# EAGLE design lab3 (EAGLE 7.6.0)
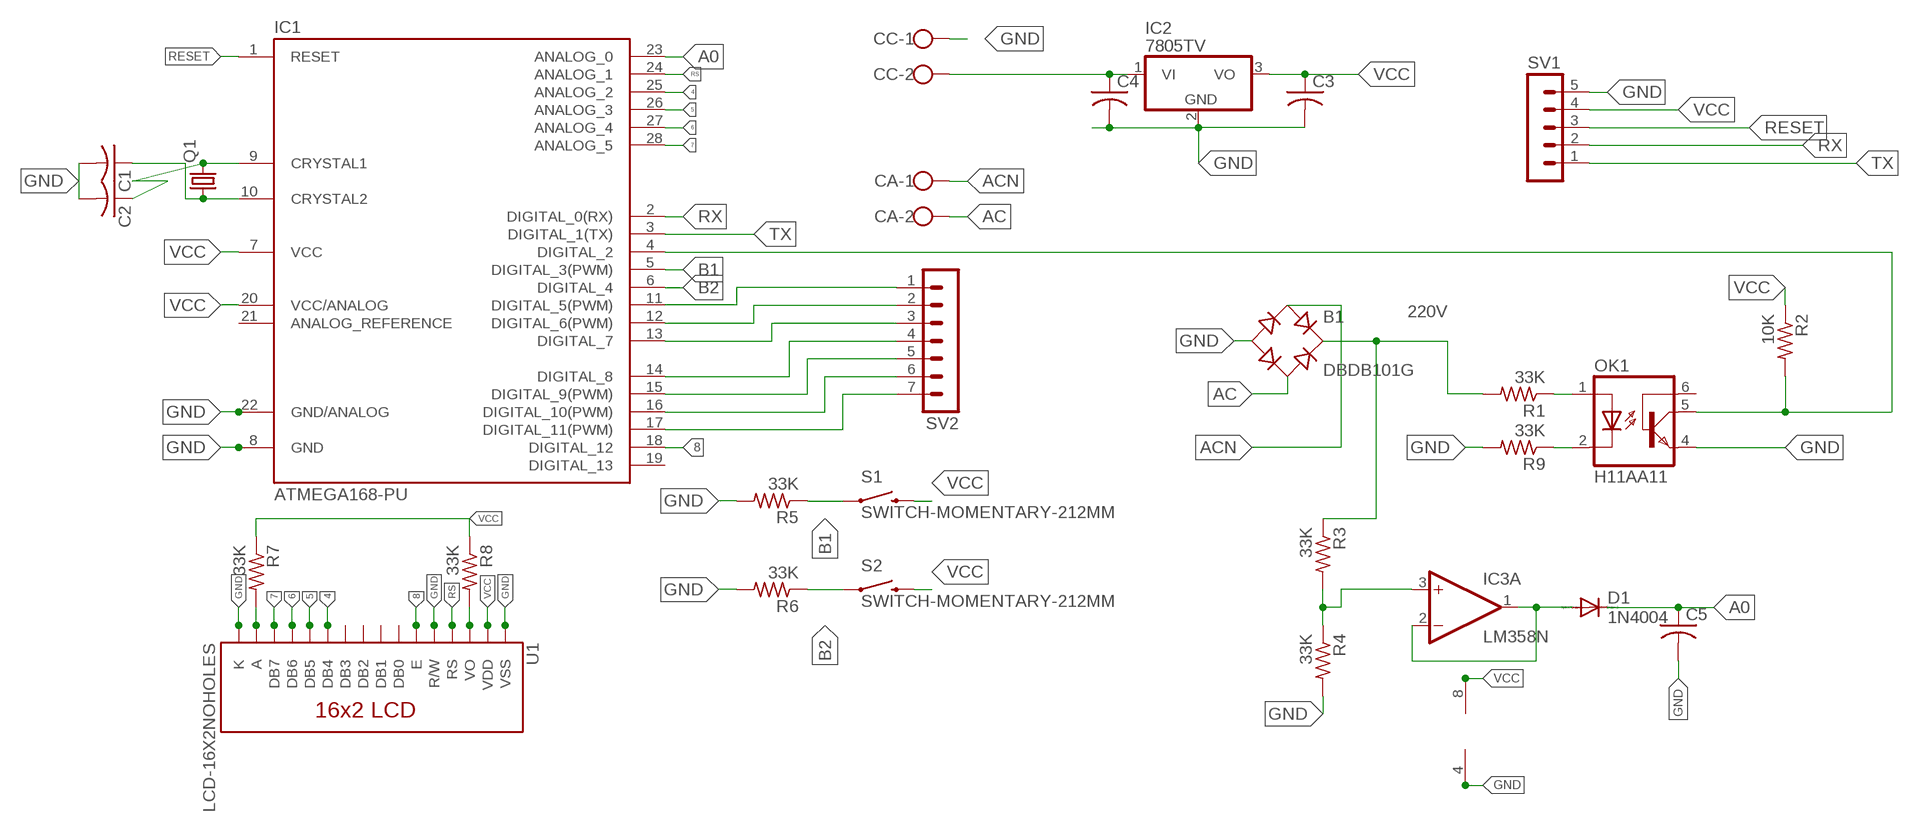
[diagram p0: schematic, sheet 1]

## Parts
B1  DBDB101G  [DB]
C1  C-US025-025X050  [C025-025X050]
C2  C-US025-025X050  [C025-025X050]
C3  C-US050-025X075  [C050-025X075]
C4  C-US050-025X075  [C050-025X075]
C5  C-US050-025X075  [C050-025X075]
CA  W237-102  [W237-102]
CC  W237-102  [W237-102]
D1  1N4004  [DO41-10]
IC1  ATMEGA168-PU  [DIL28-3]
IC2  7805TV  [TO220V]
IC3  LM358N  [DIL08]
OK1  H11AA11  [DIL06]
Q1  CRYSTALHC18U-V  [HC18U-V]
R1  33K  R-US_0207/7  [0207/7]
R2  10K  R-US_0207/7  [0207/7]
R3  33K  R-US_0207/7  [0207/7]
R4  33K  R-US_0207/7  [0207/7]
R5  33K  R-US_0207/7  [0207/7]
R6  33K  R-US_0207/7  [0207/7]
R7  33K  R-US_0207/7  [0207/7]
R8  33K  R-US_0207/7  [0207/7]
R9  33K  R-US_0207/7  [0207/7]
S1  SWITCH-MOMENTARY-212MM  [TACTILE-PTH-12MM]
S2  SWITCH-MOMENTARY-212MM  [TACTILE-PTH-12MM]
SV1  MA05-1  [MA05-1]
SV2  MA07-1  [MA07-1]
U1  LCD-16X2NOHOLES  [LCD-16X2_NOHOLES]

## Nets
4: IC1.25(ANALOG_2) U1.11(DB4)
5: IC1.26(ANALOG_3) U1.12(DB5)
6: IC1.27(ANALOG_4) U1.13(DB6)
7: IC1.28(ANALOG_5) U1.14(DB7)
8: IC1.18(DIGITAL_12) U1.6(E)
220V: B1.+ R1.2 R3.1
A0: C5.1 D1.C IC1.23(ANALOG_0)
AC: B1.AC2 CA.2
ACN: B1.AC1 CA.1
B1: IC1.5(DIGITAL_3(PWM)) R5.1 S1.1
B2: IC1.6(DIGITAL_4) R6.1 S2.1
DIG02: IC1.4(DIGITAL_2) OK1.5(COL) R2.2
GND: B1.- C1.2 C2.2 C3.2 C4.2 C5.2 CC.1 IC1.8(GND) IC1.22(GND/ANALOG) IC2.2(GND) IC3.4(P:V-) OK1.4(EMI) R4.2 R5.2 R6.2 R9.2 SV1.5 U1.1(VSS) U1.5(R/W) U1.16(K)
N$1: R7.2 U1.15(A)
N$2: D1.A IC3.1(A:OUT) IC3.2(A:-IN)
N$3: IC3.3(A:+IN) R3.2 R4.1
N$4: OK1.2(C) R9.1
N$5: IC1.11(DIGITAL_5(PWM)) SV2.1
N$6: OK1.1(A) R1.1
N$8: C2.1 IC1.9(CRYSTAL1) Q1.2
N$9: C1.1 IC1.10(CRYSTAL2) Q1.1
N$10: IC1.12(DIGITAL_6(PWM)) SV2.2
N$11: IC1.13(DIGITAL_7) SV2.3
N$12: C4.1 CC.2 IC2.1(VI)
N$13: IC1.14(DIGITAL_8) SV2.4
N$14: IC1.15(DIGITAL_9(PWM)) SV2.5
N$15: IC1.16(DIGITAL_10(PWM)) SV2.6
N$16: R8.2 U1.3(VO)
N$17: IC1.17(DIGITAL_11(PWM)) SV2.7
RESET: IC1.1(RESET) SV1.3
RS: IC1.24(ANALOG_1) U1.4(RS)
RX: IC1.2(DIGITAL_0(RX)) SV1.2
TX: IC1.3(DIGITAL_1(TX)) SV1.1
VCC: C3.1 IC1.7(VCC) IC1.20(VCC/ANALOG) IC2.3(VO) IC3.8(P:V+) R2.1 R7.1 R8.1 S1.3 S2.3 SV1.4 U1.2(VDD)
Unconnected: IC1.19(DIGITAL_13) IC1.21(ANALOG_REFERENCE) IC3.5(B:+IN) IC3.6(B:-IN) IC3.7(B:OUT) OK1.6(BAS) U1.7(DB0) U1.8(DB1) U1.9(DB2) U1.10(DB3)

## Library data of the parts
B1 = rectifier:DB?*G: Single Phase 1.0 AMP Glass Passivated Bridge Rectifier Taiwan Semiconductor Co.,Ltd. - TSC Source: http://www.taiwansemi.com/TSCbig5/ezcatfiles/cust/img/img/db101g.pdf http://www.ts.com.tw/db/pictures/modules/PDT/PDT060207001/DBLS201G.pdf
C1-C5 = adafruit:C-US: CAPACITOR, American symbol
CA CC = con-wago-500:W237-102: WAGO SCREW CLAMP; MPN: 237-102; OC_FARNELL: unknown; OC_NEWARK: 70K9898
D1 = diode:1N4004: DIODE general purpose rectifier, 1 A
IC1 = Arduino-AVR:ATMEGA168-PU
IC2 = linear:78*: Positive VOLTAGE REGULATOR Source: http://cache.national.com/ds/LM/LM78L05.pdf http://www.fairchildsemi.com/ds/LM/LM7805.pdf
IC3 = linear:LM358: OP AMP also LM158; LM258; LM2904 Source: http://cache.national.com/ds/LM/LM158.pdf
OK1 = twomey:H11AA1: Optocoupler AC Input 1 Channel Trans W/Base DC Output 6-Pin DIP Source: http://www.jameco.com/webapp/wcs/stores/servlet/Product_10001_10001_18825_-1; MPN: H11A1-M; OC_FARNELL: 1021358; OC_NEWARK: 97K1793
Q1 = adafruit:CRYSTAL: CRYSTAL; OC_FARNELL: unknown; OC_NEWARK: unknown
R1-R9 = adafruit:R-US_: RESISTOR, American symbol
S1 S2 = SparkFun-Electromechanical:SWITCH-MOMENTARY-2: Various NO switches- pushbuttons, reed, etc; PROD_ID: SWCH-09185
SV1 = con-lstb:MA05-1: PIN HEADER; OC_FARNELL: unknown; OC_NEWARK: unknown
SV2 = con-lstb:MA07-1: PIN HEADER; OC_FARNELL: unknown; OC_NEWARK: unknown
U1 = SparkFun-Displays:LCD-16X2: Standard text-only 16x2 parallel input LCD

## Board
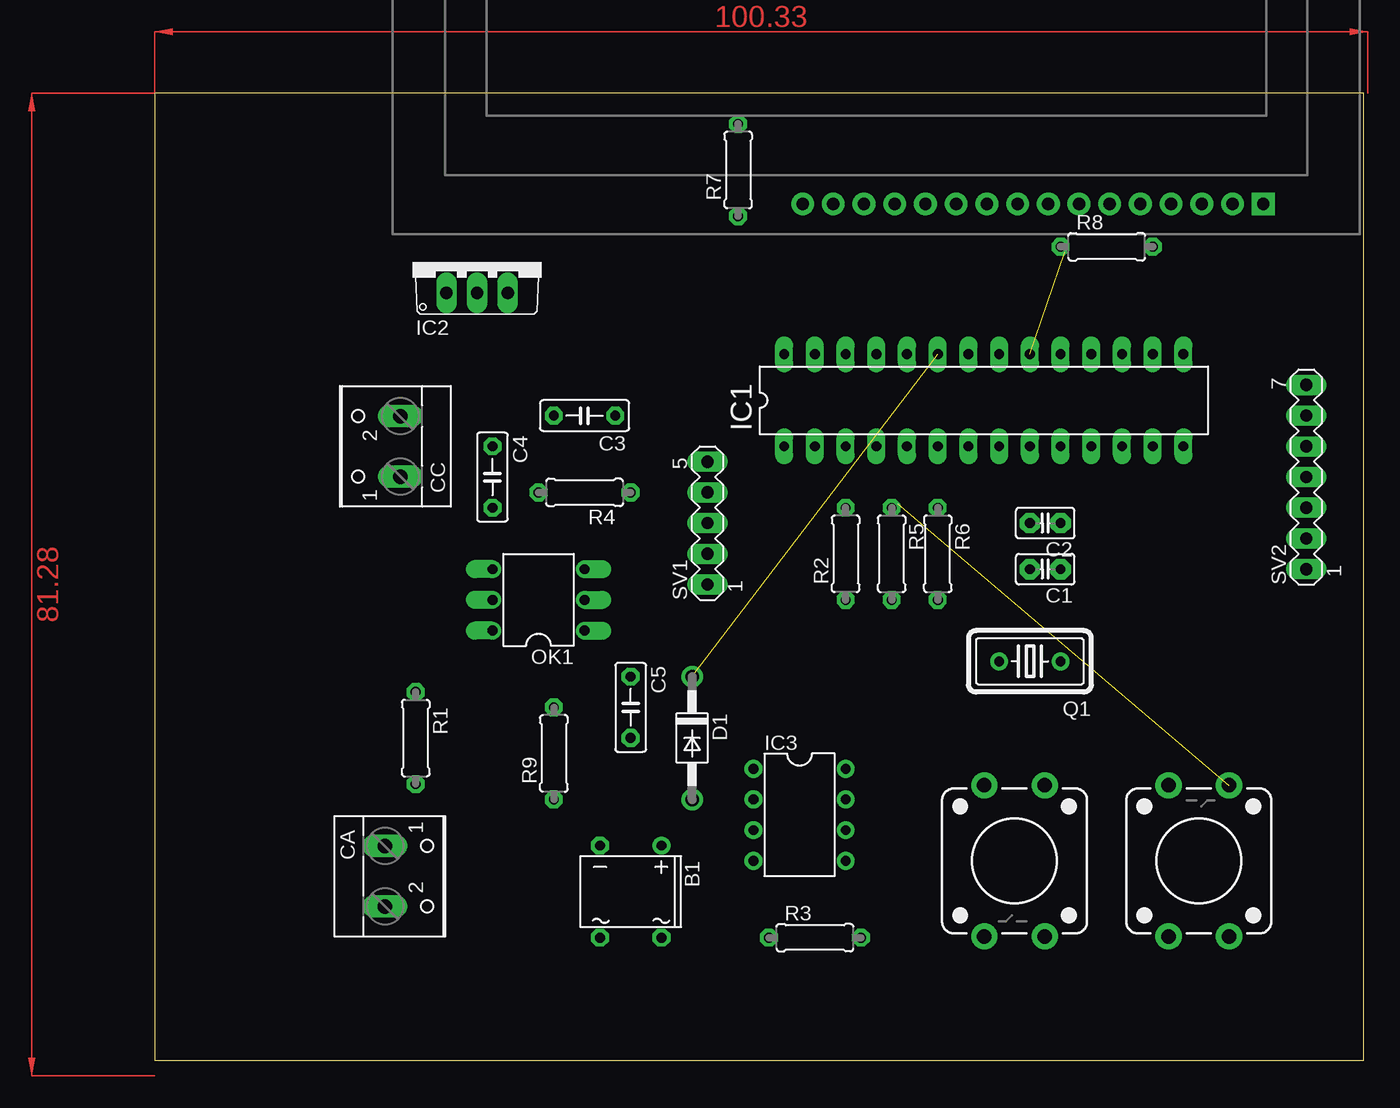
[diagram p1: board, top side]
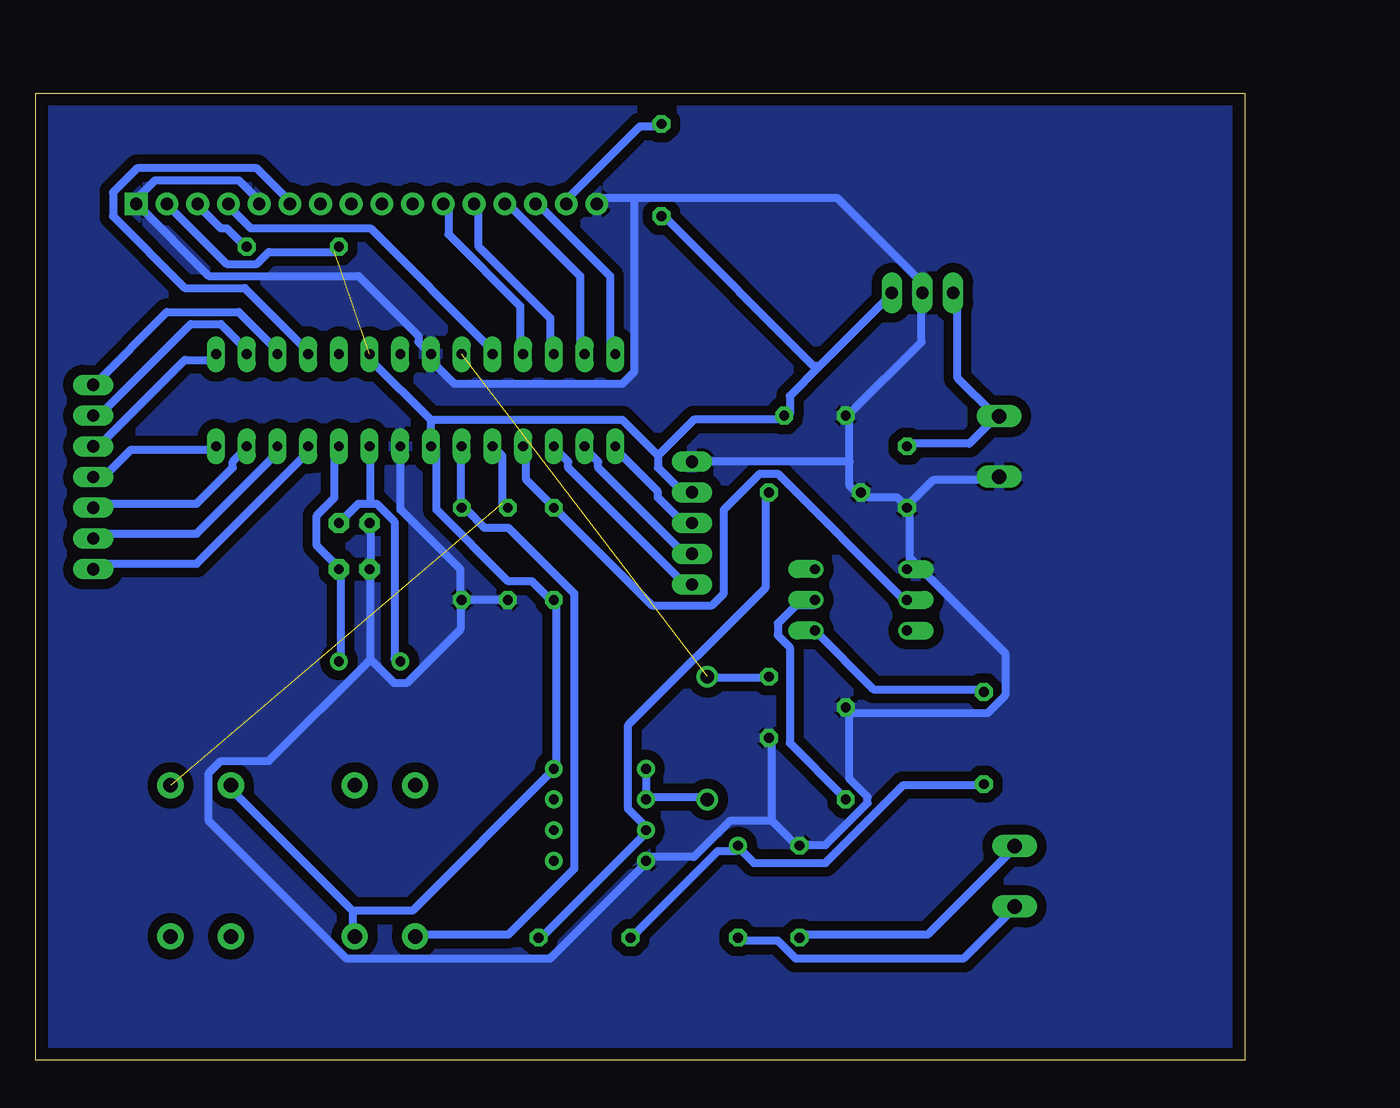
[diagram p2: board, bottom side, seen from below]

Size 100 x 80 mm. Coordinates in mm from the lower left corner, seen from the top.
Outline: 0,0 100,0 100,80 0,80 0,0
Copper layers (1*16): Top 0.035mm / dielectric 1.5mm / Bottom 0.035mm
Design rules "default *": minimum track width 26mil, minimum drill 26mil, track to track 13mil, track to pad 13mil, pad to pad 13mil, via to via 13mil, smd to smd 13mil, copper to edge 40mil, drill to drill 8mil, minimum pad ring 13mil, minimum via ring 13mil, stop-mask expansion 4mil, vias tented up to drill 0mil, thermal gap 10mil

### Footprints (pad centres in the part's own frame; a part is rotated, then mirrored left to right if it is on the bottom)
DB = drill 0.813: + -2.54,-3.81 | drill 0.813 octagon: - 2.54,-3.81; AC1 2.54,3.81; AC2 -2.54,3.81
C025-025X050 = drill 0.813 pad 1.676 octagon: 1 -1.27,0; 2 1.27,0
C050-025X075 = drill 0.813 octagon: 1 -2.54,0; 2 2.54,0
W237-102 = drill 1.194 long: 1 -2.5,-1.27; 2 2.5,-1.27
DO41-10 = drill 1.118: A 5.08,0; C -5.08,0
DIL28-3 = drill 0.813 long: 1 -16.51,-3.81; 2 -13.97,-3.81; 3 -11.43,-3.81; 4 -8.89,-3.81; 5 -6.35,-3.81; 6 -3.81,-3.81; 7 -1.27,-3.81; 8 1.27,-3.81; 9 3.81,-3.81; 10 6.35,-3.81; 11 8.89,-3.81; 12 11.43,-3.81; 13 13.97,-3.81; 14 16.51,-3.81; 15 16.51,3.81; 16 13.97,3.81; 17 11.43,3.81; 18 8.89,3.81; 19 6.35,3.81; 20 3.81,3.81; 21 1.27,3.81; 22 -1.27,3.81; 23 -3.81,3.81; 24 -6.35,3.81; 25 -8.89,3.81; 26 -11.43,3.81; 27 -13.97,3.81; 28 -16.51,3.81
TO220V = drill 1.016 long: 1 -2.54,-2.54; 2 0,-2.54; 3 2.54,-2.54
DIL08 = drill 0.813 pad 1.27: 1 -3.81,-3.81; 2 -1.27,-3.81; 3 1.27,-3.81; 4 3.81,-3.81; 5 3.81,3.81; 6 1.27,3.81; 7 -1.27,3.81; 8 -3.81,3.81
DIL06 = drill 0.813 offset: 1 -2.54,-3.81; 2 0,-3.81; 3 2.54,-3.81; 4 2.54,3.81; 5 0,3.81; 6 -2.54,3.81
HC18U-V = drill 0.813: 1 -2.54,0; 2 2.54,0
0207/7 = drill 0.813 octagon: 1 -3.81,0; 2 3.81,0
TACTILE-PTH-12MM = drill 1.2 pad 2.159: 1 6.25,-2.5; 2 -6.25,-2.5; 3 6.25,2.5; 4 -6.25,2.5
MA05-1 = drill 1.016 long: 1 -5.08,0; 2 -2.54,0; 3 0,0; 4 2.54,0; 5 5.08,0
MA07-1 = drill 1.016 long: 1 -7.62,0; 2 -5.08,0; 3 -2.54,0; 4 0,0; 5 2.54,0; 6 5.08,0; 7 7.62,0
LCD-16X2_NOHOLES = drill 1.016 pad 1.88 square: 1 -32,15.5 | drill 1.016 pad 1.88: 2 -29.46,15.5; 3 -26.92,15.5; 4 -24.38,15.5; 5 -21.84,15.5; 6 -19.3,15.5; 7 -16.76,15.5; 8 -14.22,15.5; 9 -11.68,15.5; 10 -9.14,15.5; 11 -6.6,15.5; 12 -4.06,15.5; 13 -1.52,15.5; 14 1.02,15.5; 15 3.56,15.5; 16 6.1,15.5

### Placement (x,y rotation side)
B1  39.37,13.97 180 top
C1  73.66,40.64 180 top
C2  73.66,44.45 180 top
C3  35.56,53.34 180 top
C4  27.94,48.26 270 top
C5  39.37,29.21 270 top
CA  20.32,15.24 270 top
CC  19.05,50.8 90 top
D1  44.45,26.67 270 top
IC1  68.58,54.61 0 top
IC2  26.67,66.04 0 top
IC3  53.34,20.32 270 top
OK1  31.75,38.1 90 top
Q1  72.39,33.02 180 top
R1  21.59,26.67 270 top
R2  57.15,41.91 90 top
R3  54.61,10.16 0 top
R4  35.56,46.99 180 top
R5  60.96,41.91 270 top
R6  64.77,41.91 270 top
R7  48.26,73.66 90 top
R8  78.74,67.31 0 top
R9  33.02,25.4 90 top
S1  86.36,16.51 90 top
S2  71.12,16.51 270 top
SV1  45.72,44.45 90 top
SV2  95.25,48.26 90 top
U1  59.69,86.36 180 top

### Tracks (layer width: path | path; a pad name or v marks a point on that pad's centre or on a via)
4
  Bottom 0.66: IC1.25 59.93,58.45 59.93,62.41 65.88,68.35 65.88,70.83 U1.11
5
  Bottom 0.66: IC1.26 57.45,58.45 57.45,61.42 63.4,67.36 63.4,70.83 U1.12
6
  Bottom 0.66: IC1.27 54.98,58.45 54.98,64.88 60.92,70.83 U1.13
7
  Bottom 0.66: IC1.28 52.5,58.45 52.5,64.88 58.45,70.83 U1.14
8
  Bottom 0.66: IC1.18 77.76,58.45 77.76,58.94 82.72,63.89 87.67,63.89 93.61,69.84 93.61,71.82 91.63,73.8 81.72,73.8 79.25,71.32 U1.6
220V
  Bottom 0.66: R3.1 50.52,10.4 43.59,17.34 42.1,17.34 B1.+ 41.6,17.34 40.62,16.34 34.67,16.34 28.23,22.78 21.79,22.78 R1.2
A0  (1 unrouted)
  Bottom 0.66: C5.1 39.62,31.7 44.08,31.7 D1.C
AC
  Bottom 0.66: B1.AC2 41.6,9.91 38.63,9.91 37.15,8.42 23.28,8.42 19.32,12.38 CA.2
ACN
  Bottom 0.66: B1.AC1 36.65,10.4 26.25,10.4 19.32,17.34 CA.1
B1  (1 unrouted)
  Bottom 0.66: R5.1 61.42,46.06 61.42,50.02 61.91,50.52 IC1.5
B2
  Bottom 0.66: IC1.6 64.88,50.52 64.88,46.06 R6.1 64.39,45.57 62.9,44.08 60.92,44.08 55.47,38.63 55.47,15.85 60.92,10.4 68.35,10.4 S2.1
DIG02
  Bottom 0.66: OK1.5 28.23,38.14 38.63,48.54 40.12,48.54 43.09,45.57 43.09,38.63 44.08,37.64 49.03,37.64 56.96,45.57 R2.2 57.45,46.06 59.44,48.04 59.44,50.52 IC1.4
GND
  Bottom 0.66: U1.5 81.72,71.32 83.21,72.81 90.14,72.81 91.63,71.32 U1.1 91.63,70.83 85.69,64.88 73.3,64.88 68.35,59.93 68.35,59.44 67.36,58.45 IC1.22 66.86,57.95 66.86,57.45 65.38,55.97 51.51,55.97 50.52,56.96 50.52,71.32 | C2.2 72.31,44.08 72.31,41.11 C1.2 72.31,40.62 72.31,33.19 | R5.2 61.42,38.14 64.39,38.14 R6.2 | IC1.8 69.84,50.52 69.84,45.57 64.88,40.62 64.88,38.14 R6.2 | 72.31,33.19 70.33,31.2 69.34,31.2 64.88,35.66 64.88,37.64 R6.2 | 32.69,28.73 32.69,23.28 31.2,21.79 31.2,21.3 34.67,17.83 36.65,17.83 B1.- 37.15,17.83 39.13,19.81 | 39.13,19.81 39.13,26.25 C5.2 | 39.13,19.81 42.6,19.81 45.57,16.84 49.53,16.84 IC3.4 49.53,16.34 57.45,8.42 74.3,8.42 85.69,19.81 85.69,23.77 84.7,24.77 80.73,24.77 72.31,33.19 | 27.74,41.6 27.74,45.57 C4.2 | 27.74,41.6 27.74,41.11 OK1.4 | C4.2 28.23,46.06 28.73,46.56 31.7,46.56 R4.2 32.19,47.05 32.69,47.55 32.69,49.53 | 32.69,49.53 32.69,53 C3.2 32.69,53.49 26.75,59.44 26.75,63.4 IC2.2 26.25,63.89 33.68,71.32 50.52,71.32 | 32.69,49.53 SV1.5 | CC.1 20.8,48.04 25.76,48.04 27.74,46.06 C4.2 | 50.52,71.32 53.49,71.32 U1.16 | 32.69,28.73 21.3,28.73 19.81,30.21 19.81,33.68 27.74,41.6 | 32.69,28.73 R9.2
  pour Bottom (isolate 0.813): 0,80.01 0,0 100.33,0 100.33,80.01
N$1
  Bottom 0.66: R7.2 48.54,77.27 50.02,77.27 55.97,71.32 U1.15
N$2
  Bottom 0.66: IC3.1 49.53,21.79 | 49.53,21.79 44.58,21.79 D1.A | 49.53,21.79 IC3.2
N$3
  Bottom 0.66: R3.2 57.95,10.4 49.53,18.82 IC3.3 49.53,19.32 51.02,20.8 51.02,27.74 39.62,39.13 39.62,46.56 R4.1
N$4
  Bottom 0.66: R9.1 33.19,21.79 37.64,26.25 37.64,34.18 38.63,35.17 38.63,36.16 37.15,37.64 35.66,37.64 OK1.2
N$5
  Bottom 0.66: IC1.11 77.76,50.52 77.76,50.02 86.68,41.11 95.1,41.11 SV2.1
N$6
  Bottom 0.66: OK1.1 30.71,30.71 21.79,30.71 R1.1
N$8
  Bottom 0.66: 72.31,46.06 73.3,46.06 74.79,44.58 C2.1 | 72.31,46.06 71.82,46.06 70.33,44.58 70.33,33.19 Q1.2 | 72.31,46.06 72.31,50.52 IC1.9
N$9
  Bottom 0.66: Q1.1 74.79,33.19 74.79,40.62 C1.1 75.29,41.11 76.77,42.6 76.77,45.07 75.29,46.56 75.29,50.52 IC1.10
N$10
  Bottom 0.66: IC1.12 80.24,50.52 80.24,50.02 86.68,43.59 95.1,43.59 SV2.2
N$11
  Bottom 0.66: IC1.13 82.72,50.52 83.71,49.53 83.71,49.03 86.68,46.06 95.1,46.06 SV2.3
N$12
  Bottom 0.66: C4.1 27.74,51.02 22.78,51.02 20.8,53 CC.2 20.8,53.49 23.77,56.46 23.77,63.4 IC2.1
N$13
  Bottom 0.66: IC1.14 85.19,50.52 92.13,50.52 94.11,48.54 95.1,48.54 SV2.4
N$14
  Bottom 0.66: IC1.15 85.19,57.95 87.67,57.95 95.1,50.52 SV2.5
N$15
  Bottom 0.66: IC1.16 82.72,58.45 82.72,58.94 84.7,60.92 87.17,60.92 95.1,53 SV2.6
N$16
  Bottom 0.66: R8.2 82.72,67.36 84.2,68.85 84.7,68.85 86.68,70.83 U1.3
N$17
  Bottom 0.66: IC1.17 80.24,58.45 80.24,58.94 83.21,61.91 89.15,61.91 95.1,55.97 SV2.7
RESET
  Bottom 0.66: IC1.1 52.01,50.52 48.54,47.05 48.54,46.56 46.06,44.08 SV1.3
RS
  Bottom 0.66: IC1.24 62.41,58.45 62.41,58.94 72.31,68.85 82.22,68.85 84.2,70.83 U1.4
RX
  Bottom 0.66: IC1.2 54.48,50.52 53.49,49.53 53.49,49.03 46.06,41.6 SV1.2
TX
  Bottom 0.66: IC1.3 56.96,50.52 55.97,49.53 55.97,49.03 46.06,39.13 SV1.1
VCC  (1 unrouted)
  Bottom 0.66: R8.1 75.29,66.86 80.73,66.86 81.72,65.88 84.2,65.88 89.15,70.83 U1.2 | 35.17,57.45 29.22,63.4 IC2.3 | 35.17,57.45 37.64,54.98 37.64,53.49 C3.1 38.14,53 45.57,53 48.54,50.02 | 35.17,57.45 35.66,57.45 48.04,69.84 R7.1 | 48.54,50.02 48.54,49.03 46.56,47.05 46.06,47.05 SV1.4 | 73.8,12.38 73.8,10.4 S2.3 | 73.8,12.38 83.71,22.29 S1.3 | 67.36,53 67.36,51.02 IC1.7 66.86,50.52 66.86,45.57 60.92,39.62 58.94,39.62 57.45,38.14 R2.1 56.96,37.64 56.96,24.27 IC3.8 57.45,23.77 68.85,12.38 73.8,12.38 | 67.36,53 72.31,57.95 IC1.20 | 48.54,50.02 51.51,53 67.36,53
(copper drawn outside any net)
  shapes: Top area x2